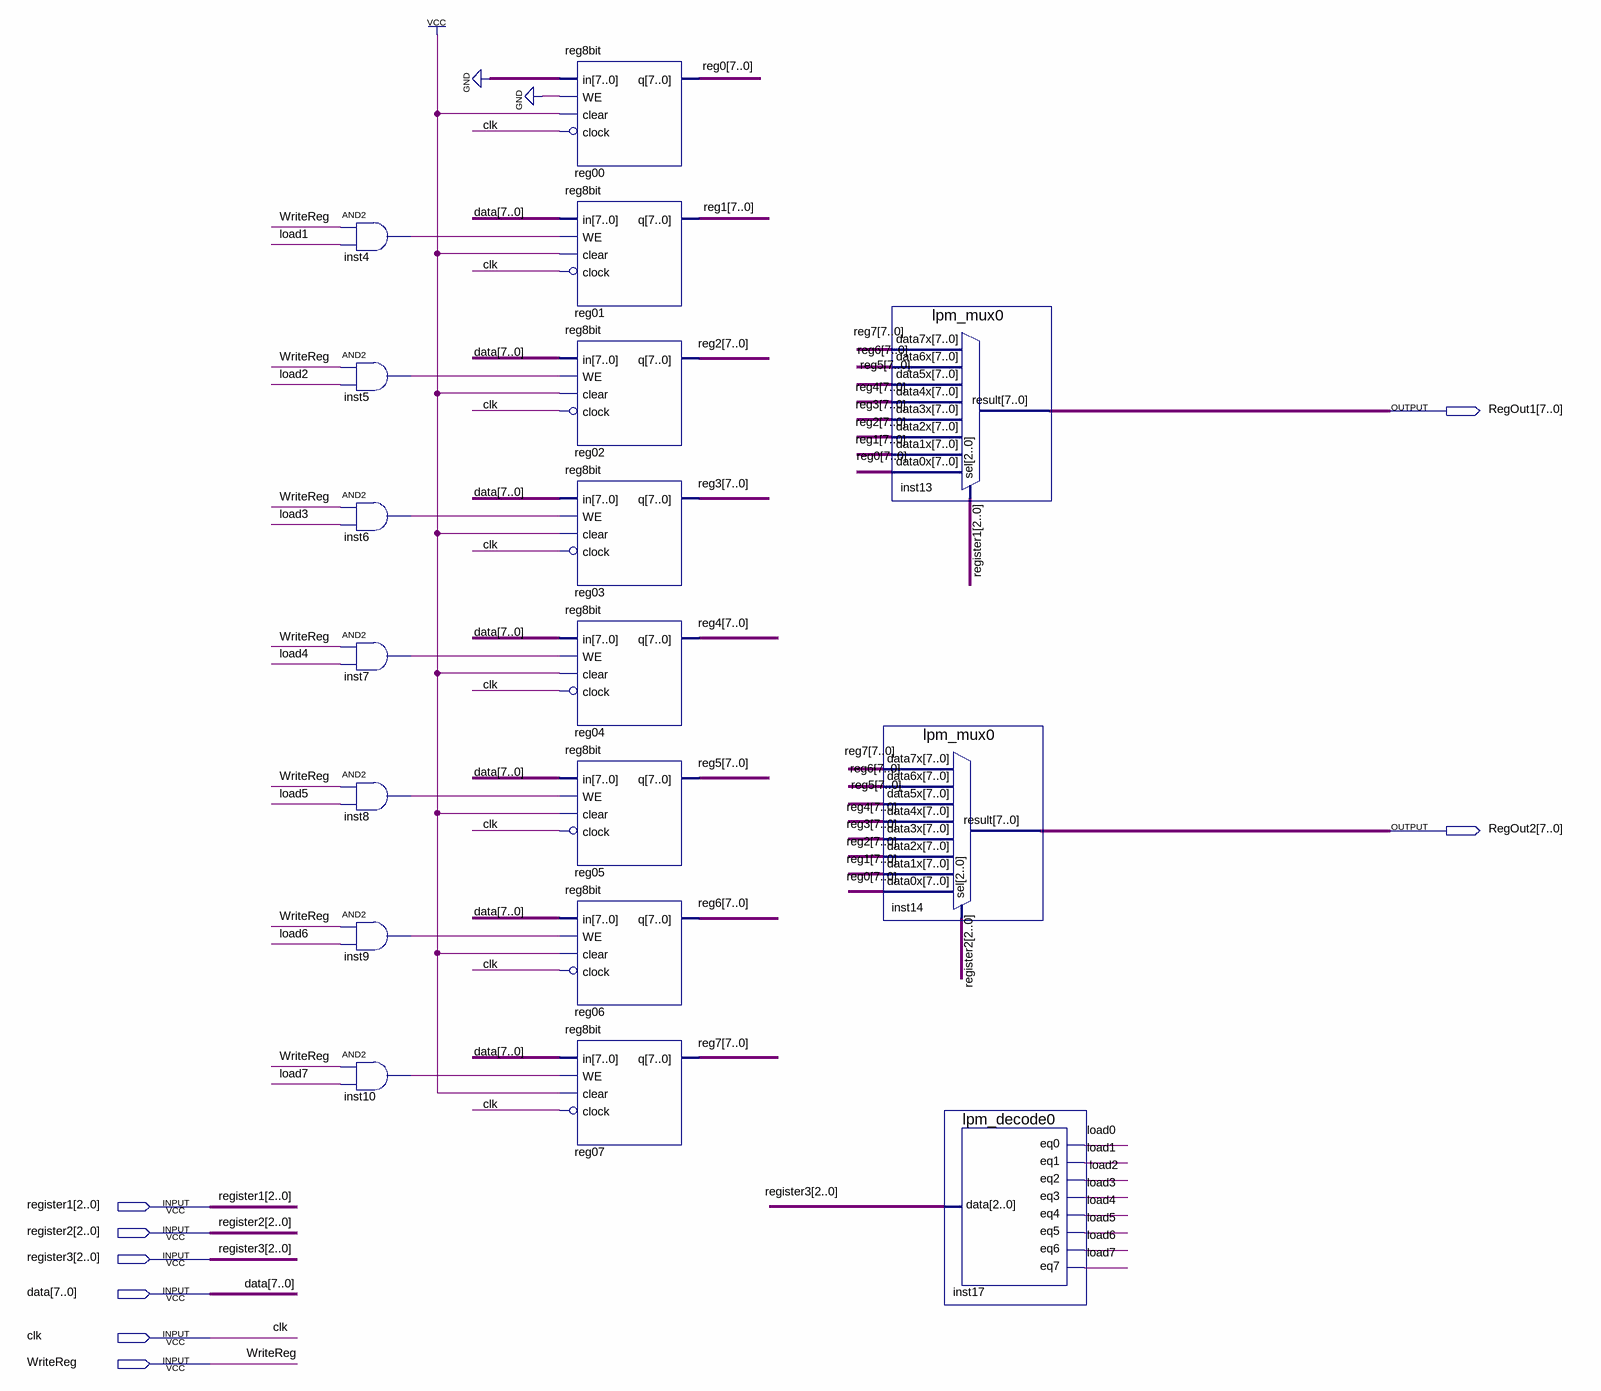
[diagram p0: schematic sheet]
// Quartus schematic register_file.bdf as structural Verilog: 18 symbols, 8 pins
module register_file (
  input  [2:0] register1,
  input  [2:0] register2,
  input  [2:0] register3,
  input  [7:0] data,
  input  clk,
  input  WriteReg,
  output [7:0] RegOut1,
  output [7:0] RegOut2
);

  wire inst4_out, inst5_out, inst6_out, inst7_out, inst8_out, inst9_out, inst10_out, load0, load1, load2,
       load3, load4, load5, load6, load7;
  wire [7:0] reg0, reg1, reg2, reg3, reg4, reg5, reg6, reg7;

  and inst4 (inst4_out, WriteReg, load1);
  and inst5 (inst5_out, WriteReg, load2);
  and inst6 (inst6_out, WriteReg, load3);
  and inst7 (inst7_out, WriteReg, load4);
  and inst8 (inst8_out, WriteReg, load5);
  and inst9 (inst9_out, WriteReg, load6);
  and inst10 (inst10_out, WriteReg, load7);
  reg8bit reg00 (.WE(1'b0), .clear(1'b1), .clock(~clk), .in({8{1'b0}}), .q(reg0));
  reg8bit reg01 (.WE(inst4_out), .clear(1'b1), .clock(~clk), .in(data), .q(reg1));
  reg8bit reg02 (.WE(inst5_out), .clear(1'b1), .clock(~clk), .in(data), .q(reg2));
  reg8bit reg03 (.WE(inst6_out), .clear(1'b1), .clock(~clk), .in(data), .q(reg3));
  reg8bit reg04 (.WE(inst7_out), .clear(1'b1), .clock(~clk), .in(data), .q(reg4));
  reg8bit reg05 (.WE(inst8_out), .clear(1'b1), .clock(~clk), .in(data), .q(reg5));
  reg8bit reg06 (.WE(inst9_out), .clear(1'b1), .clock(~clk), .in(data), .q(reg6));
  reg8bit reg07 (.WE(inst10_out), .clear(1'b1), .clock(~clk), .in(data), .q(reg7));
  lpm_mux0 inst13 (
    .data7x(reg7), .data6x(reg6), .data5x(reg5), .data4x(reg4), .data3x(reg3), .data2x(reg2), .data1x(reg1),
    .data0x(reg0), .sel(register1), .result(RegOut1));
  lpm_mux0 inst14 (
    .data7x(reg7), .data6x(reg6), .data5x(reg5), .data4x(reg4), .data3x(reg3), .data2x(reg2), .data1x(reg1),
    .data0x(reg0), .sel(register2), .result(RegOut2));
  lpm_decode0 inst17 (
    .data(register3), .eq0(load0), .eq1(load1), .eq2(load2), .eq3(load3), .eq4(load4), .eq5(load5),
    .eq6(load6), .eq7(load7));
endmodule
